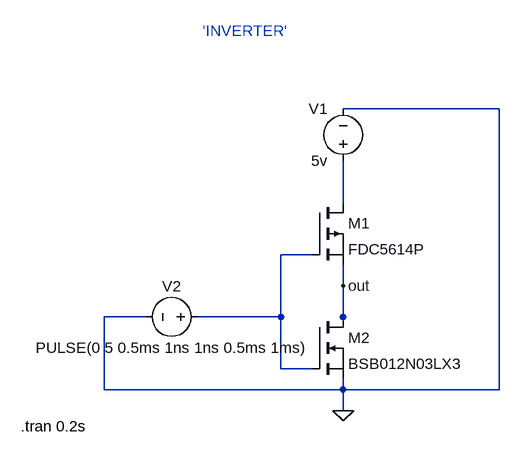
[diagram p0: schematic 13.Inverter.asc]
13.Inverter.asc, the LTspice schematic file:
Version 4
SHEET 1 880 680
WIRE 400 -16 160 -16
WIRE 160 128 160 64
WIRE 112 208 64 208
WIRE 160 256 160 224
WIRE -144 304 -208 304
WIRE 64 304 64 208
WIRE 64 304 -64 304
WIRE 160 304 160 256
WIRE 160 320 160 304
WIRE 64 384 64 304
WIRE 112 384 64 384
WIRE -208 416 -208 304
WIRE 160 416 160 400
WIRE 160 416 -208 416
WIRE 400 416 400 -16
WIRE 400 416 160 416
WIRE 160 448 160 416
FLAG 160 448 0
FLAG 160 256 out
SYMBOL pmos 112 128 R0
SYMATTR InstName M1
SYMATTR Value FDC5614P
SYMBOL nmos 112 304 R0
SYMATTR InstName M2
SYMATTR Value BSB012N03LX3
SYMBOL voltage 160 80 R180
WINDOW 0 24 96 Left 2
WINDOW 3 24 16 Left 2
WINDOW 123 0 0 Left 0
WINDOW 39 0 0 Left 0
SYMATTR InstName V1
SYMATTR Value 5v
SYMBOL voltage -48 304 R90
WINDOW 0 -32 56 VBottom 2
WINDOW 3 32 56 VTop 2
WINDOW 123 0 0 Left 0
WINDOW 39 0 0 Left 0
SYMATTR InstName V2
SYMATTR Value PULSE(0 5 0.5ms 1ns 1ns 0.5ms 1ms)
TEXT -336 472 Left 2 !.tran 0.2s
TEXT -56 -136 Left 2 ;'INVERTER'

The netlist it stands for:
* 13.Inverter.asc
M1 N001 N002 out out FDC5614P
M2 out N002 0 0 BSB012N03LX3
V1 N001 0 5v
V2 N002 0 PULSE(0 5 0.5ms 1ns 1ns 0.5ms 1ms)
.model NMOS NMOS
.model PMOS PMOS
.lib standard.mos
.tran 0.2s
* 'INVERTER'
.backanno
.end